# EAGLE design MTL_BaroTact1D_V4 (EAGLE 9.6.2)
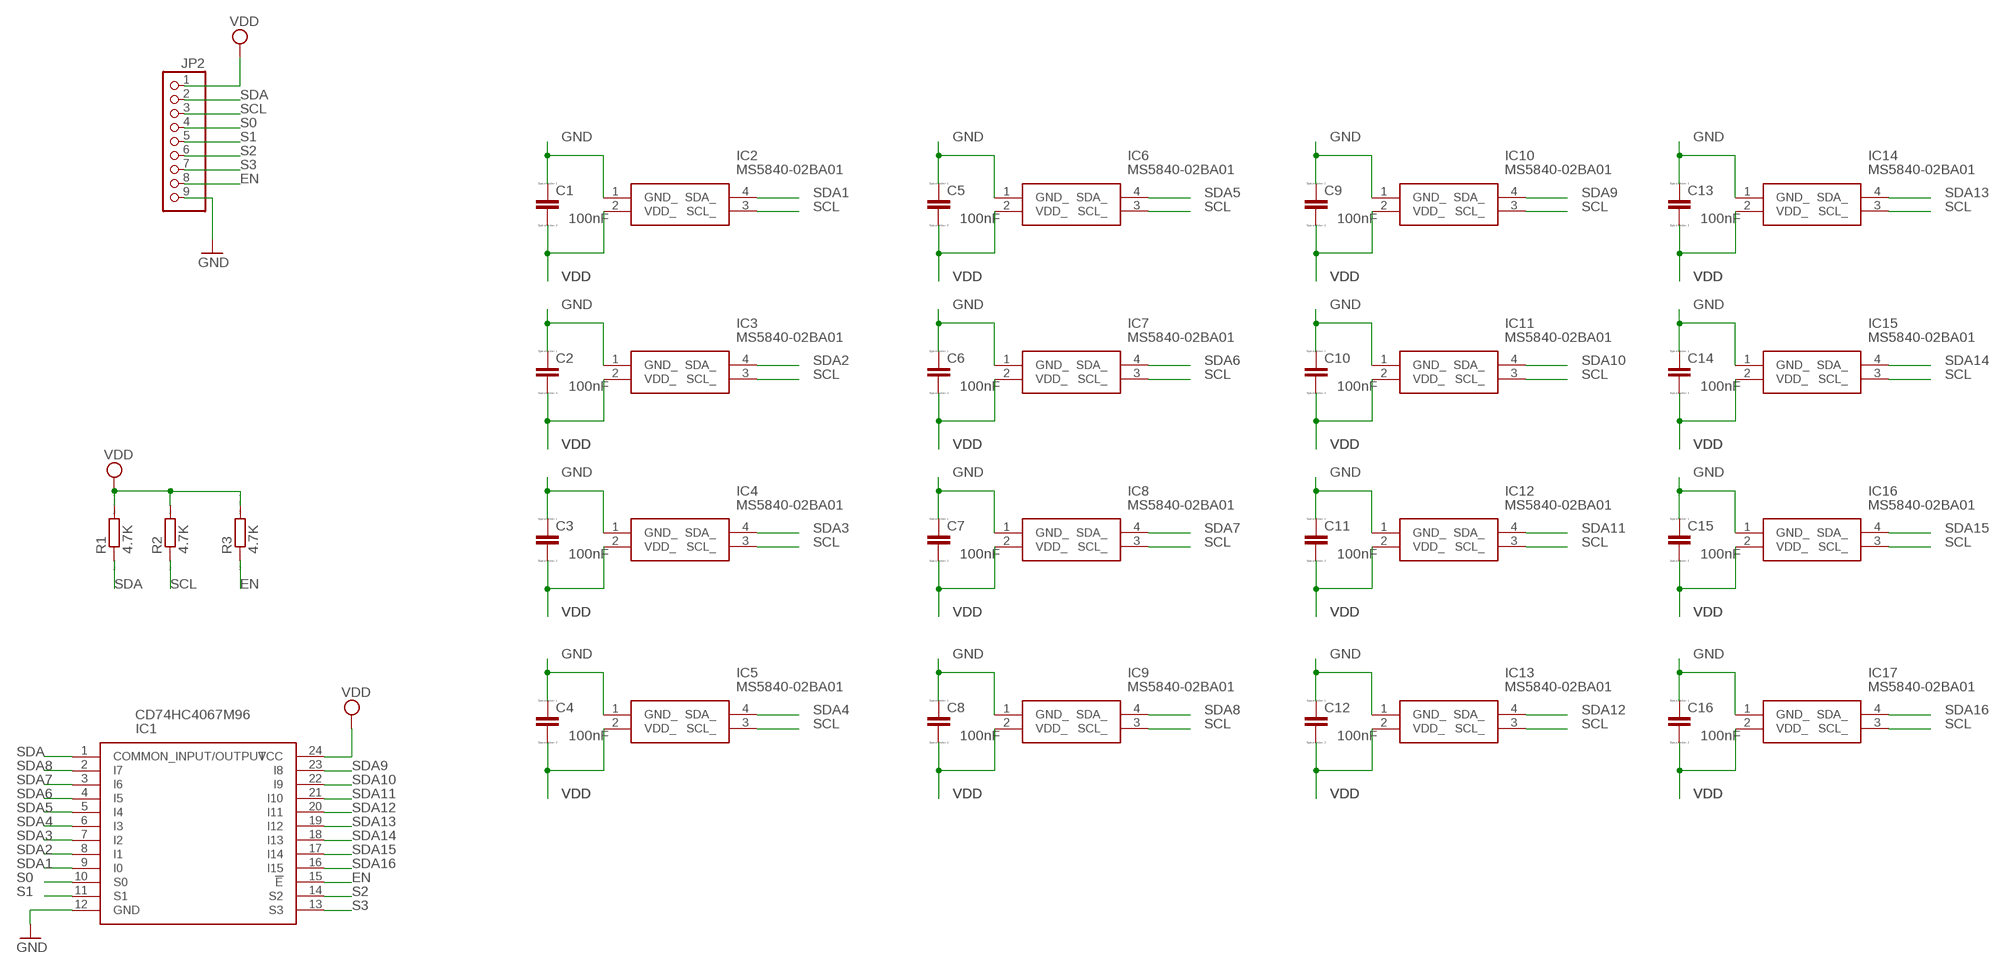
[diagram p0: schematic, sheet 1]

## Parts
C1  100nF  CC0603  [C0603]
C2  100nF  CC0603  [C0603]
C3  100nF  CC0603  [C0603]
C4  100nF  CC0603  [C0603]
C5  100nF  CC0603  [C0603]
C6  100nF  CC0603  [C0603]
C7  100nF  CC0603  [C0603]
C8  100nF  CC0603  [C0603]
C9  100nF  CC0603  [C0603]
C10  100nF  CC0603  [C0603]
C11  100nF  CC0603  [C0603]
C12  100nF  CC0603  [C0603]
C13  100nF  CC0603  [C0603]
C14  100nF  CC0603  [C0603]
C15  100nF  CC0603  [C0603]
C16  100nF  CC0603  [C0603]
IC1  CD74HC4067M96  [SOIC127P1030X265-24N]
IC2  MS5840-02BA01  [MS584002BA01]
IC3  MS5840-02BA01  [MS584002BA01]
IC4  MS5840-02BA01  [MS584002BA01]
IC5  MS5840-02BA01  [MS584002BA01]
IC6  MS5840-02BA01  [MS584002BA01]
IC7  MS5840-02BA01  [MS584002BA01]
IC8  MS5840-02BA01  [MS584002BA01]
IC9  MS5840-02BA01  [MS584002BA01]
IC10  MS5840-02BA01  [MS584002BA01]
IC11  MS5840-02BA01  [MS584002BA01]
IC12  MS5840-02BA01  [MS584002BA01]
IC13  MS5840-02BA01  [MS584002BA01]
IC14  MS5840-02BA01  [MS584002BA01]
IC15  MS5840-02BA01  [MS584002BA01]
IC16  MS5840-02BA01  [MS584002BA01]
IC17  MS5840-02BA01  [MS584002BA01]
JP2  PINHD-1X9  [1X09]
R1  4.7K  RR0603  [R0603]
R2  4.7K  RR0603  [R0603]
R3  4.7K  RR0603  [R0603]

## Nets
EN [EN]: IC1.15(!E) JP2.8 R3.1
GND: C1.1 C2.1 C3.1 C4.1 C5.1 C6.1 C7.1 C8.1 C9.1 C10.1 C11.1 C12.1 C13.1 C14.1 C15.1 C16.1 IC1.12(GND) IC2.1(GND_) IC3.1(GND_) IC4.1(GND_) IC5.1(GND_) IC6.1(GND_) IC7.1(GND_) IC8.1(GND_) IC9.1(GND_) IC10.1(GND_) IC11.1(GND_) IC12.1(GND_) IC13.1(GND_) IC14.1(GND_) IC15.1(GND_) IC16.1(GND_) IC17.1(GND_) JP2.9
S0 [S0]: IC1.10(S0) JP2.4
S1 [S1]: IC1.11(S1) JP2.5
S2 [S2]: IC1.14(S2) JP2.6
S3 [S3]: IC1.13(S3) JP2.7
SCL [SCL]: IC2.3(SCL_) IC3.3(SCL_) IC4.3(SCL_) IC5.3(SCL_) IC6.3(SCL_) IC7.3(SCL_) IC8.3(SCL_) IC9.3(SCL_) IC10.3(SCL_) IC11.3(SCL_) IC12.3(SCL_) IC13.3(SCL_) IC14.3(SCL_) IC15.3(SCL_) IC16.3(SCL_) IC17.3(SCL_) JP2.3 R2.1
SDA [SDA]: IC1.1(COMMON_INPUT/OUTPUT) JP2.2 R1.1
SDA1: IC1.9(I0) IC2.4(SDA_)
SDA2: IC1.8(I1) IC3.4(SDA_)
SDA3: IC1.7(I2) IC4.4(SDA_)
SDA4: IC1.6(I3) IC5.4(SDA_)
SDA5: IC1.5(I4) IC6.4(SDA_)
SDA6: IC1.4(I5) IC7.4(SDA_)
SDA7: IC1.3(I6) IC8.4(SDA_)
SDA8: IC1.2(I7) IC9.4(SDA_)
SDA9: IC1.23(I8) IC10.4(SDA_)
SDA10: IC1.22(I9) IC11.4(SDA_)
SDA11: IC1.21(I10) IC12.4(SDA_)
SDA12: IC1.20(I11) IC13.4(SDA_)
SDA13: IC1.19(I12) IC14.4(SDA_)
SDA14: IC1.18(I13) IC15.4(SDA_)
SDA15: IC1.17(I14) IC16.4(SDA_)
SDA16: IC1.16(I15) IC17.4(SDA_)
VDD: C1.2 C2.2 C3.2 C4.2 C5.2 C6.2 C7.2 C8.2 C9.2 C10.2 C11.2 C12.2 C13.2 C14.2 C15.2 C16.2 IC1.24(VCC) IC2.2(VDD_) IC3.2(VDD_) IC4.2(VDD_) IC5.2(VDD_) IC6.2(VDD_) IC7.2(VDD_) IC8.2(VDD_) IC9.2(VDD_) IC10.2(VDD_) IC11.2(VDD_) IC12.2(VDD_) IC13.2(VDD_) IC14.2(VDD_) IC15.2(VDD_) IC16.2(VDD_) IC17.2(VDD_) JP2.1 R1.2 R2.2 R3.2

## Library data of the parts
C1-C16 = eagle-ltspice:C: CAPACITOR, European symbol; SPICEMODEL: NONE; SPICEPREFIX: C
IC1 = CD74HC4067M96:CD74HC4067M96: High Speed CMOS 16-Channel Analog Multiplexer/Demultiplexer Source: Datasheet <http://www.ti.com/lit/gpn/cd74hc4067>; DESCRIPTION: High Speed CMOS 16-Channel Analog Multiplexer/Demultiplexer; HEIGHT: 2.65mm; MANUFACTURER_NAME: Texas Instruments; MANUFACTURER_PART_NUMBER: CD74HC4067M96; MOUSER_PART_NUMBER: 595-CD74HC4067M96; MOUSER_PRICE-STOCK: https://www.mouser.co.uk/ProductDetail/Texas-Instruments/CD74HC4067M96?qs=xFfolx0DHx0XT7d9xTTZBA%3D%3D
IC2-IC17 = MS5840-02BA01:MS5840-02BA01: Board Mount Pressure Sensors LP PRESS SENSOR T&R Source: Datasheet; DESCRIPTION: Board Mount Pressure Sensors LP PRESS SENSOR T&R; HEIGHT: 1.7mm; MANUFACTURER_NAME: TE Connectivity; MANUFACTURER_PART_NUMBER: MS5840-02BA01; MOUSER_PART_NUMBER: 824-MS5840-02BA01; MOUSER_PRICE-STOCK: https://www.mouser.co.uk/ProductDetail/Measurement-Specialties/MS5840-02BA01?qs=gZXFycFWdAN7%252BD1H1Y3uGA%3D%3D
JP2 = pinhead:PINHD-1X9: PIN HEADER
R1-R3 = eagle-ltspice:R: RESISTOR, European symbol; SPICEMODEL: NONE; SPICEPREFIX: R

## Board
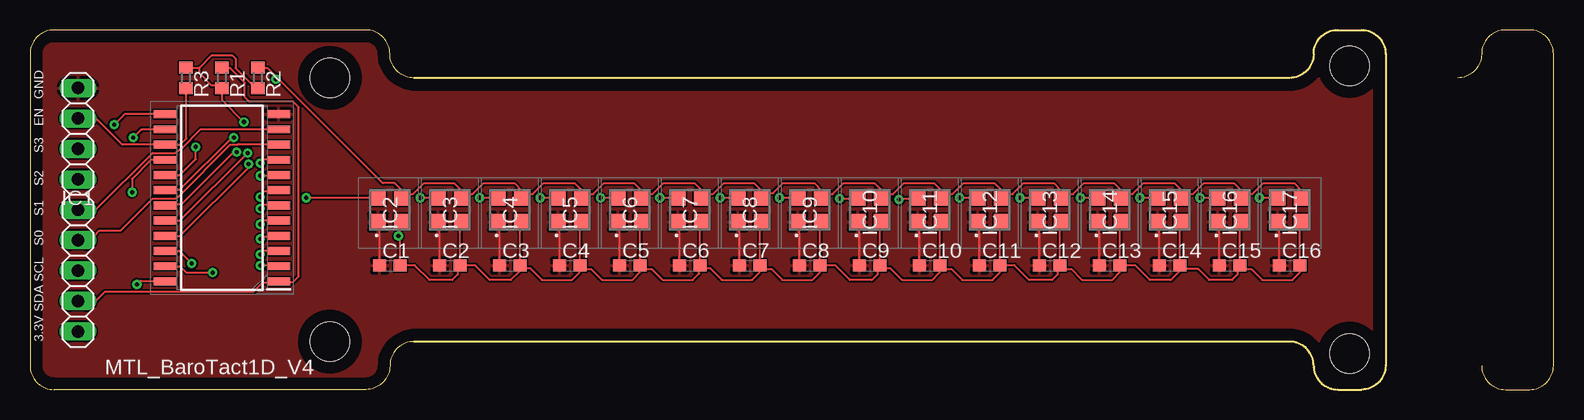
[diagram p1: board, top side]
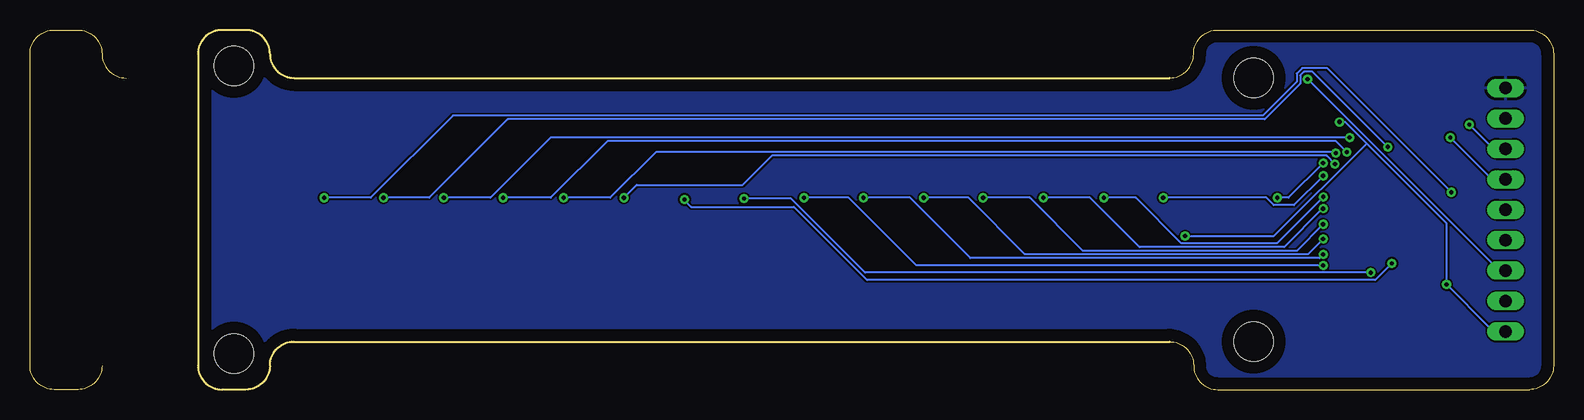
[diagram p2: board, bottom side, seen from below]

Size 127 x 30 mm. Coordinates in mm from the lower left corner, seen from the top.
Outline: 119,26 arc90 121,28 arc-90 123,30 125,30 arc-90 127,28 127,2 arc-90 125,0 123,0 arc-90 121,2
Outline: 0,28 0,2 arc90 2,0 28,0 arc90 30,2 arc-90 32,4 105,4 arc-90 107,2 arc90 109,0 111,0 arc90 113,2 113,28 arc90 111,30 109,30 arc90 107,28 arc-90 105,26 32,26 arc-90 30,28 arc90 28,30 2,30 arc90 0,28
Copper layers (1*16): Top 0.035mm / dielectric 1.5mm / Bottom 0.035mm
Design rules "default": minimum track width 6mil, minimum drill 0.35mm, track to track 6mil, track to pad 6mil, pad to pad 6mil, via to via 6mil, smd to smd 6mil, copper to edge 40mil, drill to drill 6mil, minimum pad ring 10mil, minimum via ring 8mil, stop-mask expansion 4mil, vias tented up to drill 0mil, thermal gap 10mil
Holes 3.3 mm at 110,27 110,3 25,26 25,4

### Footprints (pad centres in the part's own frame; a part is rotated, then mirrored left to right if it is on the bottom)
C0603 = smd 1.1 x 1: 1 -0.85,0; 2 0.85,0
SOIC127P1030X265-24N = smd 1.95 x 0.65: 1 -4.725,6.985; 2 -4.725,5.715; 3 -4.725,4.445; 4 -4.725,3.175; 5 -4.725,1.905; 6 -4.725,0.635; 7 -4.725,-0.635; 8 -4.725,-1.905; 9 -4.725,-3.175; 10 -4.725,-4.445; 11 -4.725,-5.715; 12 -4.725,-6.985; 13 4.725,-6.985; 14 4.725,-5.715; 15 4.725,-4.445; 16 4.725,-3.175; 17 4.725,-1.905; 18 4.725,-0.635; 19 4.725,0.635; 20 4.725,1.905; 21 4.725,3.175; 22 4.725,4.445; 23 4.725,5.715; 24 4.725,6.985
MS584002BA01 = smd 1.3 x 1.3: 1 -1,1; 2 -1,-1; 3 1,-1; 4 1,1
1X09 = drill 1.016 long: 1 -10.16,0; 2 -7.62,0; 3 -5.08,0; 4 -2.54,0; 5 0,0; 6 2.54,0; 7 5.08,0; 8 7.62,0; 9 10.16,0
R0603 = smd 1 x 1.1: 1 -0.85,0; 2 0.85,0

### Placement (x,y rotation side)
C1  30,10.33 0 top
C2  35,10.33 0 top
C3  40,10.33 0 top
C4  45,10.33 0 top
C5  50,10.33 0 top
C6  55,10.33 0 top
C7  60,10.33 0 top
C8  65,10.33 0 top
C9  70,10.33 0 top
C10  75,10.33 0 top
C11  80,10.33 0 top
C12  85,10.33 0 top
C13  90,10.33 0 top
C14  95,10.33 0 top
C15  100,10.33 0 top
C16  105,10.33 0 top
IC1  16,16 180 top
IC2  30,15 90 top
IC3  35,15 90 top
IC4  40,15 90 top
IC5  45,15 90 top
IC6  50,15 90 top
IC7  55,15 90 top
IC8  60,15 90 top
IC9  65,15 90 top
IC10  70,15 90 top
IC11  75,15 90 top
IC12  80,15 90 top
IC13  85,15 90 top
IC14  90,15 90 top
IC15  95,15 90 top
IC16  100,15 90 top
IC17  105,15 90 top
JP2  4,15 90 top
R1  16,26 270 top
R2  19,26 270 top
R3  13,26 90 top

### Tracks (layer width: path | path; a pad name or v marks a point on that pad's centre or on a via)
EN
  Top 0.152: R3.1 13.03,25.15 13.03,20.95 12.5,20.42 11.28,20.42 IC1.15 11.2,20.42 7.7,20.42 5.49,22.63 4.04,22.63 JP2.8
GND
  Top 0.152: C16.1 104.15,13.85 IC17.1 | C15.1 99.15,13.85 IC16.1 | C14.1 94.15,13.85 IC15.1 | C13.1 89.15,13.85 IC14.1 | C12.1 84.15,13.85 IC13.1 | C11.1 79.15,13.85 IC12.1 | C10.1 74.15,13.85 IC11.1 | C9.1 69.15,13.85 IC10.1 | C8.1 64.15,13.85 IC9.1 | C7.1 59.15,13.85 IC8.1 | C6.1 54.15,13.85 IC7.1 | C5.1 49.15,13.85 IC6.1 | C4.1 44.15,13.85 IC5.1 | C3.1 39.15,13.85 IC4.1 | C2.1 34.15,13.85 IC3.1 | C1.1 29.15,13.85 IC2.1
  pour Top: 0,2 2,0 28,0 30,2 30,4 113,4 113,26 30,26 30,28 28,30 2,30 0,28
  pour Bottom: 0,2 2,0 28,0 30,2 30,4 113,4 113,26 30,26 30,28 28,30 2,30 0,28
S0
  Top 0.152: IC1.10 20.65,20.5 17.37,20.5 17.3,20.42 16.69,20.42 12.34,16.08 12.27,16.08 12.12,15.93 10.21,15.93 7.54,13.26 5.79,13.26 5.33,12.8 4.34,12.8 4.04,12.5 JP2.4
S1
  Top 0.152: IC1.11 20.65,21.72 14.25,21.72 12.65,20.12 12.57,20.12 12.34,19.89 12.27,19.89 12.12,19.74 10.21,19.74 5.49,15.01 4.04,15.01 JP2.5
S2  (via drill 0.35)
  Top 0.152: v8.61,21.03 9.3,21.72 11.2,21.72 IC1.14
  Bottom 0.152: v8.61,21.03 5.18,17.6 4.04,17.6 JP2.6
S3  (via drill 0.35)
  Top 0.152: v7.01,22.1 7.92,23.01 11.2,23.01 IC1.13
  Bottom 0.152: v7.01,22.1 5.33,20.42 4.34,20.42 4.04,20.12 JP2.7
SCL  (via drill 0.35)
  Top 0.152: 20.61,26.02 29.41,17.22 30.4,17.22 31.01,16.61 31.01,16.31 | 20.61,26.02 19.81,26.82 19.05,26.82 R2.1 | 31.01,16.31 31.01,16 IC2.3 31.01,16.31 | 35.97,16.31 35.97,16.61 35.36,17.22 32.84,17.22 31.93,16.31 31.01,16.31 | 35.97,16.31 35.97,16 IC3.3 35.97,16.31 | 41,16.31 41,16.61 40.39,17.22 37.8,17.22 36.88,16.31 35.97,16.31 | 41,16.31 IC4.3 41,16.31 | 45.95,16.31 45.95,16.69 45.41,17.22 42.82,17.22 41.91,16.31 41,16.31 | 45.95,16.31 45.95,16 IC5.3 45.95,16.31 | 50.98,16.31 50.98,16.61 50.37,17.22 47.85,17.22 46.94,16.31 45.95,16.31 | 50.98,16.31 50.98,16 IC6.3 50.98,16.31 | 55.93,16.31 55.93,16.69 55.4,17.22 52.81,17.22 51.89,16.31 50.98,16.31 | 55.93,16.31 55.93,16 IC7.3 55.93,16.31 | 60.96,16.38 60.96,16.61 60.35,17.22 57.84,17.22 56.92,16.31 55.93,16.31 | 60.96,16.38 60.96,16 IC8.3 60.96,16.38 | 65.99,16.31 65.99,16.61 65.38,17.22 62.79,17.22 61.95,16.38 60.96,16.38 | 65.99,16.31 IC9.3 65.99,16.31 | 70.94,16.31 70.94,16.69 70.41,17.22 67.82,17.22 66.9,16.31 65.99,16.31 | 70.94,16.31 70.94,16 IC10.3 70.94,16.31 | 75.97,16.31 75.97,16.61 75.36,17.22 72.85,17.22 71.93,16.31 70.94,16.31 | 75.97,16.31 75.97,16 IC11.3 75.97,16.31 | 80.92,16.31 80.92,16.69 80.39,17.22 77.8,17.22 76.89,16.31 75.97,16.31 | 80.92,16.31 80.92,16 IC12.3 80.92,16.31 | 85.95,16.31 85.95,16.61 85.34,17.22 82.83,17.22 81.92,16.31 80.92,16.31 | 85.95,16.31 85.95,16 IC13.3 85.95,16.31 | 90.98,16.31 90.98,16.61 90.37,17.22 87.86,17.22 86.94,16.31 85.95,16.31 | 90.98,16.31 90.98,16 IC14.3 90.98,16.31 | 95.94,16.31 95.94,16.69 95.4,17.22 92.81,17.22 91.9,16.31 90.98,16.31 | 95.94,16.31 95.94,16 IC15.3 95.94,16.31
  Top 0.152: 100.97,16.31 100.97,16.61 100.36,17.22 97.84,17.22 96.93,16.31 95.94,16.31 | 100.97,16.31 100.97,16 IC16.3 100.97,16.31 | 100.97,16.31 101.88,16.31 102.79,17.22 105.39,17.22 105.99,16.61 IC17.3 | 20.61,26.02 v20.5,25.91
  Bottom 0.152: v20.5,25.91 4.57,9.98 4.04,9.98 JP2.3
SDA
  Top 0.152: R1.1 16,26.82 16.69,26.82 17.91,25.6 17.91,24.38 18.29,24 21.95,24 22.4,23.55 22.4,9.45 21.95,8.99 20.73,8.99 IC1.1 20.73,8.91 19.36,8.91 18.59,8.15 6.25,8.15 5.49,7.39 4.04,7.39 JP2.2
SDA1  (via drill 0.35)
  Top 0.152: v23.01,16 28.96,16 IC2.4 | v19.2,18.9 19.51,19.2 20.65,19.2 IC1.9
  Bottom 0.152: v23.01,16 22.1,16 v19.2,18.9
SDA2  (via drill 0.35)
  Top 0.152: v32.54,16 33.98,16 IC3.4 | v19.2,17.83 20.65,17.83 IC1.8
  Bottom 0.152: v32.54,16 23.93,16 23.32,15.39 21.64,15.39 v19.2,17.83
SDA3  (via drill 0.35)
  Top 0.152: v37.49,16 38.94,16 IC4.4 | v19.18,16.08 19.18,16.2 19.51,16.54 20.57,16.54 20.65,16.61 IC1.7
  Bottom 0.152: v37.49,16 34.82,16 31.01,12.19 23.06,12.19 v19.18,16.08
SDA4  (via drill 0.35)
  Top 0.152: v42.52,16 43.97,16 IC5.4 | v19.2,15.09 19.2,15.19 19.41,15.39 20.65,15.39 IC1.6
  Bottom 0.152: v42.52,16 38.63,16 34.52,11.89 22.45,11.89 19.25,15.09 v19.2,15.09
SDA5  (via drill 0.35)
  Top 0.152: v47.55,16 IC6.4 | v19.2,13.79 19.51,14.1 20.65,14.1 IC1.5
  Bottom 0.152: v47.55,16 43.66,16 39.24,11.58 21.41,11.58 v19.2,13.79
SDA6  (via drill 0.35)
  Top 0.152: v52.5,16 53.95,16 IC7.4 | v19.2,12.57 19.36,12.72 20.57,12.72 20.65,12.8 IC1.4
  Bottom 0.152: v52.5,16 48.77,16 44.04,11.28 20.5,11.28 v19.2,12.57
SDA7  (via drill 0.35)
  Top 0.152: v57.53,16 58.98,16 IC8.4 | v19.2,11.28 19.51,11.58 20.65,11.58 IC1.3
  Bottom 0.152: v57.53,16 53.65,16 48.62,10.97 19.51,10.97 v19.2,11.28
SDA8  (via drill 0.35)
  Top 0.152: v62.48,16 63.93,16 IC9.4 | v19.2,10.36 20.57,10.36 20.65,10.29 IC1.2
  Bottom 0.152: v62.48,16 58.75,16 53.11,10.36 v19.2,10.36
SDA9  (via drill 0.35)
  Top 0.152: v67.49,15.93 68.96,15.93 IC10.4 | v15.24,9.75 13.03,9.75 12.5,10.29 IC1.23
  Bottom 0.152: v67.49,15.93 63.55,15.93 57.38,9.75 v15.24,9.75
SDA10  (via drill 0.35)
  Top 0.152: v72.44,15.85 72.52,15.93 73.99,15.93 IC11.4 | v13.49,10.52 12.42,11.58 11.28,11.58 IC1.22
  Bottom 0.152: v72.44,15.85 72.44,15.8 71.88,15.24 63.32,15.24 57.23,9.14 14.86,9.14 v13.49,10.52
SDA11  (via drill 0.35)
  Top 0.152: v77.5,16 78.94,16 IC12.4 | v18.21,18.82 18.21,18.52 12.5,12.8 11.28,12.8 IC1.21
  Bottom 0.152: v77.5,16 76.43,17.07 67.59,17.07 65.15,19.51 18.9,19.51 v18.21,18.82
SDA12  (via drill 0.35)
  Top 0.152: v82.53,16 83.97,16 IC13.4 | v18.14,19.74 12.5,14.1 IC1.20
  Bottom 0.152: v82.53,16 78.64,16 74.83,19.81 18.21,19.81 v18.14,19.74
SDA13  (via drill 0.35)
  Top 0.152: v87.55,16 88.92,16 IC14.4 | v17.22,19.81 16.99,19.81 12.65,15.47 11.35,15.47 11.28,15.39 IC1.19
  Bottom 0.152: v87.55,16 83.59,16 78.87,20.73 18.14,20.73 v17.22,19.81
SDA14  (via drill 0.35)
  Top 0.152: v92.51,16 93.95,16 IC15.4 | v16.99,21.03 16.84,21.03 12.5,16.69 11.28,16.69 IC1.18
  Bottom 0.152: v92.51,16 88.62,16 83.59,21.03 v16.99,21.03
SDA15  (via drill 0.35)
  Top 0.152: v97.54,16 98.98,16 IC16.4 | v13.82,20.24 13.82,19.23 12.5,17.91 IC1.17
  Bottom 0.152: v97.54,16 93.73,16 87.17,22.55 24.08,22.55 21.11,25.53 21.11,26.21 20.8,26.52 20.09,26.52 v13.82,20.24
SDA16  (via drill 0.35)
  Top 0.152: v102.49,16 103.94,16 IC17.4 | v8.51,16.46 8.51,17.58 10.06,19.13 11.2,19.13 IC1.16
  Bottom 0.152: v102.49,16 98.6,16 91.75,22.86 24.23,22.86 21.41,25.68 21.41,26.36 20.95,26.82 18.87,26.82 v8.51,16.46
VDD  (via drill 0.35)
  Top 0.152: 30.85,12.8 C1.2 30.86,10.36 32.08,10.36 33.3,9.14 35.2,9.14 35.66,9.6 35.66,10.13 35.81,10.29 C2.2 | 30.85,12.8 30.85,13.85 IC2.2 | C2.2 35.85,13.85 IC3.2 | C3.2 40.85,13.85 IC4.2 | C4.2 45.85,13.85 IC5.2 | C5.2 50.85,13.85 IC6.2 | C6.2 55.85,13.85 IC7.2 | C7.2 60.85,13.85 IC8.2 | C8.2 65.85,13.85 IC9.2 | C9.2 70.85,13.85 IC10.2 | C10.2 75.85,13.85 IC11.2 | C11.2 80.85,13.85 IC12.2 | C12.2 85.85,13.85 IC13.2 | C13.2 90.85,13.85 IC14.2 | C14.2 95.85,13.85 IC15.2 | C15.2 100.85,13.85 IC16.2 | IC17.2 105.85,13.85 C16.2 105.84,10.29 105.84,9.75 105.23,9.14 102.72,9.14 101.8,10.06 101.12,10.06 100.89,10.29 C15.2 | R3.2 13.03,26.82 14.1,26.82 14.14,26.86 | 14.14,26.86 15.16,27.89 16.84,27.89 17.14,27.58 17.14,26.82 18.75,25.22 18.97,25.22 R2.2 | v8.91,8.76 9.22,9.07 11.2,9.07 IC1.24 | v17.83,22.33 16,24.16 R1.2 15.93,25.22 15.77,25.38 15.16,25.38 14.14,26.4 14.14,26.86 | 95.86,10.06 95.86,10.29 C14.2 | 95.86,10.06 95.86,9.91 95.1,9.14 93.34,9.14 92.13,10.36 90.91,10.36 C13.2 | 95.86,10.06 97.38,10.06 98.3,9.14 100.2,9.14 100.66,9.6 100.66,10.13 100.81,10.29 C15.2 | 95.86,10.06 C14.2 | C11.2 80.92,10.36 82.07,10.36 83.29,9.14 85.19,9.14 85.65,9.6 85.65,10.13 85.8,10.29 C12.2 | C8.2 65.91,10.36 67.13,10.36 68.35,9.14 70.18,9.14 70.64,9.6 70.64,10.13 70.79,10.29 C9.2 | 40.84,10.13 40.84,10.29 C3.2 | 40.84,10.13 40.84,9.91 40.08,9.14 38.33,9.14 37.11,10.36 35.89,10.36 C2.2 | 45.8,10.06 45.8,9.75 45.19,9.14 42.67,9.14 41.68,10.13 40.84,10.13 | 45.8,10.06 45.8,10.29 C4.2 | 40.84,10.13 C3.2 | 50.83,10.06 50.83,9.75 50.22,9.14 47.7,9.14 46.79,10.06 45.8,10.06 | 50.83,10.06 50.83,10.29 C5.2
  Top 0.152: 45.8,10.06 C4.2 | 55.78,10.13 55.78,9.68 55.24,9.14 52.73,9.14 51.82,10.06 50.83,10.06 | 55.78,10.13 55.78,10.29 C6.2 | 50.83,10.06 C5.2 | 60.81,10.06 60.81,9.75 60.2,9.14 57.68,9.14 56.69,10.13 55.78,10.13 | 60.81,10.06 60.81,10.29 C7.2 | 55.78,10.13 C6.2 | 60.81,10.06 61.8,10.06 62.71,9.14 65.23,9.14 65.84,9.75 65.84,10.29 C8.2 | 60.81,10.06 C7.2 | 75.82,10.06 75.82,9.75 75.21,9.14 72.69,9.14 71.7,10.13 71.02,10.13 70.87,10.29 C9.2 | 75.82,10.06 75.82,10.29 C10.2 | 75.82,10.06 76.81,10.06 77.72,9.14 80.24,9.14 80.85,9.75 80.85,10.29 C11.2 | 75.82,10.06 C10.2 | C13.2 90.83,10.29 90.83,9.75 90.22,9.14 87.71,9.14 86.79,10.06 86.11,10.06 85.88,10.29 C12.2 | 30.85,12.8 v30.71,12.8
  Bottom 0.152: JP2.1 4.04,4.88 4.34,5.18 5.33,5.18 v8.91,8.76 8.91,13.87 15.58,20.54 | v17.83,22.33 17.37,22.33 15.58,20.54 | 15.58,20.54 23.32,12.8 v30.71,12.8

### Text on the board
tNames: GND | EN | S3 | S2 | S1 | S0 | SCL | SDA | 3.3V | MTL_BaroTact1D_V4
Measures: Unit: mm / Thickness: 1.6 mm